# Altium schematic sheet MCU.SchDoc
size A4; SheetNumber: 2; SheetTotal: 2
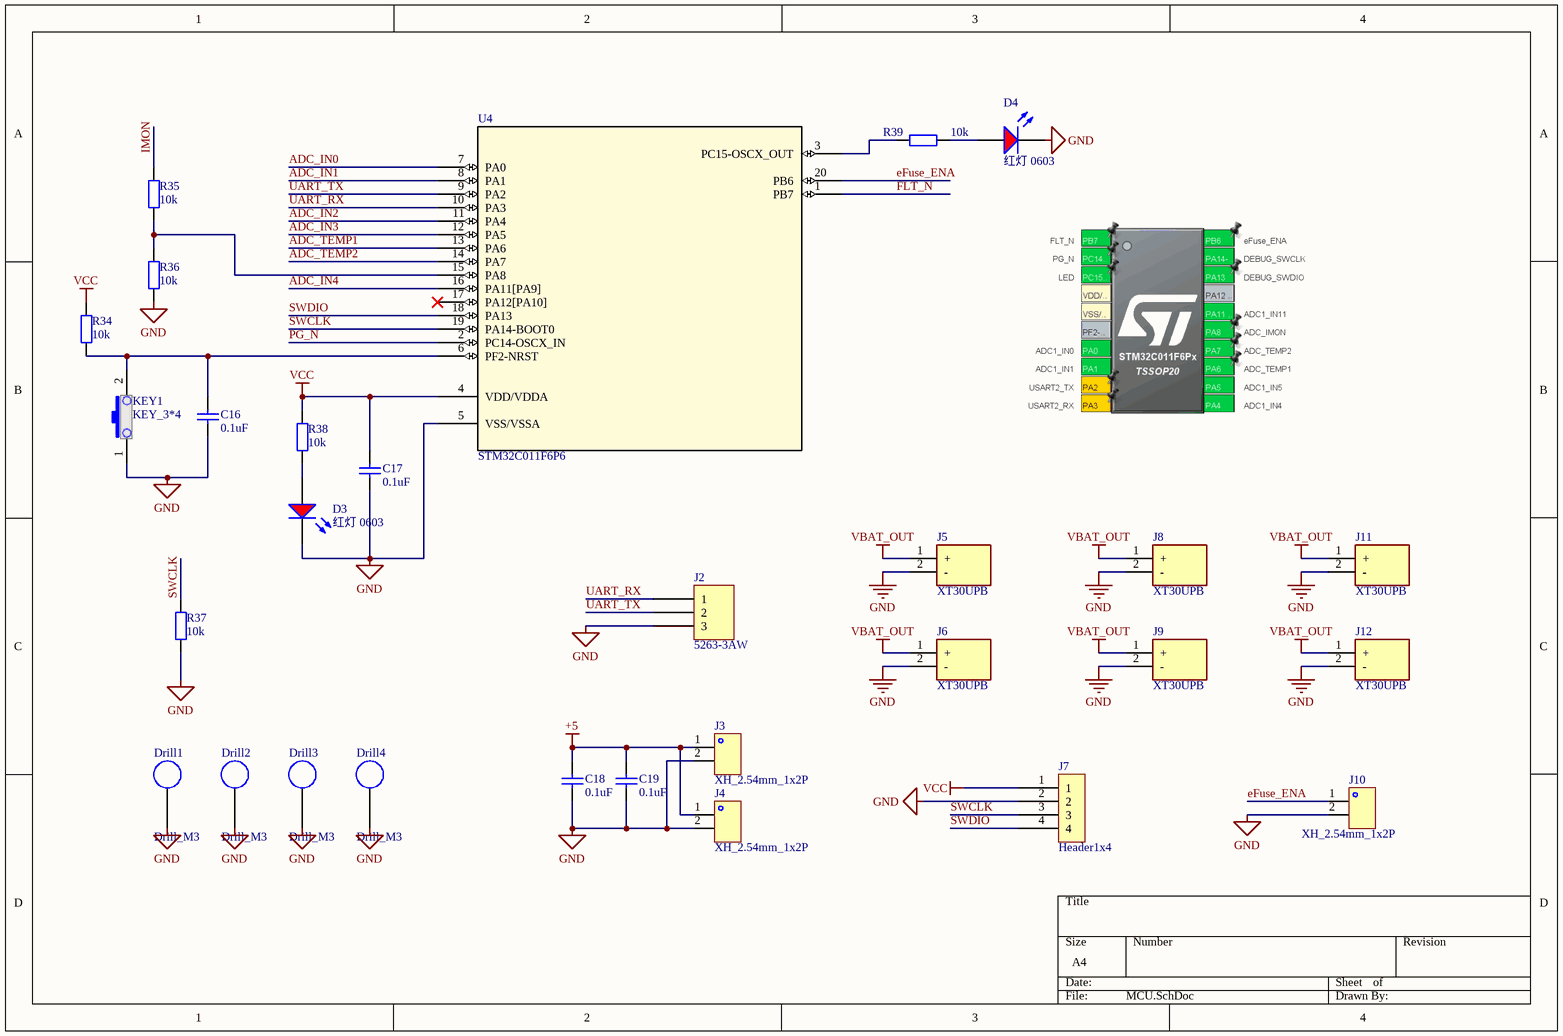
[diagram p0: MCU.SchDoc]

## Parts
C16  0.1uF  [C0603]
C17  0.1uF  [C0603]
C18  0.1uF  [C0603]
C19  0.1uF  [C0603]
D3  红灯 0603  [0603_LED_S1]
D4  红灯 0603  [0603_LED_S1]
Drill1  Drill_M3  [Drill_M_3]
Drill2  Drill_M3  [Drill_M_3]
Drill3  Drill_M3  [Drill_M_3]
Drill4  Drill_M3  [Drill_M_3]
J2  5263-3AW  [5264-3AW]
J3  XH_2.54mm_1x2P  [XH2.54mm1x2P弯插]
J4  XH_2.54mm_1x2P  [XH2.54mm1x2P弯插]
J5  XT30UPB  [XT30UPB]
J6  XT30UPB  [XT30UPB]
J7  Header1x4  [Header 1x4p]
J8  XT30UPB  [XT30UPB]
J9  XT30UPB  [XT30UPB]
J10  XH_2.54mm_1x2P  [XH2.54mm1x2P弯插]
J11  XT30UPB  [XT30UPB]
J12  XT30UPB  [XT30UPB]
KEY1  KEY_3*4  [KEY_3*4]
R34  10k  [R0603]
R35  10k  [R0603]
R36  10k  [R0603]
R37  10k  [R0603]
R38  10k  [R0603]
R39  10k  [R0603]
U4  STM32C011F6P6  [TSSOP20_STM]

## Nets
+5: C18.1 C19.1 J3.1 J4.1
GND: C16.1 C17.1 C18.2 C19.2 D3.K D4.K Drill1.0(A) Drill2.0(A) Drill3.0(A) Drill4.0(A) J2.3 J3.2 J4.2 J5.2(-) J6.2(-) J7.2 J8.2(-) J9.2(-) J10.2 J11.2(-) J12.2(-) KEY1.1 R36.1 R37.1 U4.5(VSS/VSSA)
VBAT_OUT: J5.1(+) J6.1(+) J8.1(+) J9.1(+) J11.1(+) J12.1(+)
VCC: C17.2 J7.1 R34.2 R38.1 U4.4(VDD/VDDA)
ADC_IN0: U4.7(PA0)
ADC_IN1: U4.8(PA1)
ADC_IN2: U4.11(PA4)
ADC_IN3: U4.12(PA5)
ADC_IN4: U4.16(PA11[PA9])
ADC_TEMP1: U4.13(PA6)
ADC_TEMP2: U4.14(PA7)
eFuse_ENA: J10.1 U4.20(PB6)
FLT_N: U4.1(PB7)
IMON: R35.2
PG_N: U4.2(PC14-OSCX_IN)
SWCLK: J7.3 R37.2 U4.19(PA14-BOOT0)
SWDIO: J7.4 U4.18(PA13)
UART_RX: J2.1 U4.10(PA3)
UART_TX: J2.2 U4.9(PA2)
NetC16_2: C16.2 KEY1.2 R34.1 U4.6(PF2-NRST)
NetD3_A: D3.A R38.2
NetD4_A: D4.A R39.2
NetR35_1: R35.1 R36.2 U4.15(PA8)
NetR39_1: R39.1 U4.3(PC15-OSCX_OUT)

Not connected (* = marked no-connect by the designer): U4 17(PA12[PA10])*

## Library data of the parts
C16-C19 = Capacitor
D3 D4 = 0603 红灯: 发光二极管; ComponentLink1Description: 供应商链接; ComponentLink1URL: http://www.szlcsc.com/product/details_2659.html; Package: 0603; Supplier: LC; SuppliersPartNumber: C2286
J5 J6 J8 J9 J11 J12 = XT30UPB: https://item.taobao.com/item.htm?abbucket=12&id=607162270928&ns=1&priceTId=2147810917158194959275132&sku_properties=1627207:45770027
KEY1 = KEY_3*4: C707339
R34-R39 = Resistor
U4 = STM32C011F6P6: No Description Available; Mfr_Name: STMicroelectronics; Copyright: Copyright (C) 2024 Ultra Librarian. All rights reserved.; Manufacturer_Part_Number: STM32C011F6P6; RefDes: RefDes; Type: DEV